# Altium schematic sheet Charging IC.SchDoc
size A; SheetNumber: 2; SheetTotal: 3; SPICEModelCacheWWOUKJZP: <root> / <DocumentId>WWOUKJZP</DocumentId> / <CacheFrame Number="0"> / <Model Name="umk107b7474_a-tr" Kind="CKT"> / <Text>* UMK107B7474_A-TR     SPICE MODEL  ( General Type ) / *-------------------------------------------------------------------------------------------------------- / * Model Generated by TAIYO YUDEN Corporation (http://www.ty-top.com) / * Version 1.0 / * TAIYO YUDEN Control No. 170508_110119 / * Copyright(c) 2012 TAIYO YUDEN CO.,LTD. All Rights Reserved. / *-------------------------------------------------------------------------------------------------------- / * / * Products Name : Multilayer Ceramic Capacitors / * / * Characteristics : / *     Capacitance : 0.47 uF , Rated Voltage : 50V , TCC : X7R / *     Case Size : 1.6 x 0.8 / 0.063 x 0.031 [mm/inch] , Thickness : 0.8 / 0.031 [mm/inch] / *     (Conditions: Temperature = 25 degC , DC Bias Current/Voltage = 0A / 0V) / * / * Frequency Range : 40Hz - 3GHz / * / * External Node Assignments : / * / *  1  o---| |---o  2 / * / *-------------------------------------------------------------------------------------------------------- / .SubCkt UMK107B7474_A-TR 1 2 / **************************** / C0 1 110 0.3527u / Cm 1 101 0.045459u / C1 101 102 0.11169u / Rc1 101 102 6.9463k / C2 102 103 0.051734u / Rc2 102 103 650.62 / C3 103 110 0.038139u / Rc3 103 110 34.263 / C2m 1 301 0.059649u / C21 301 302 0.33581u / Rc21 301 302 11.28k / C22 302 303 0.20392u / Rc22 302 303 18.494k / C23 303 304 0.29488u / Rc23 303 304 12.333k / C24 304 305 0.15021u / Rc24 304 305 1.1637k / C25 305 306 0.15017u / Rc25 305 306 1.0968k / C26 306 307 0.081575u / Rc26 306 307 74.316 / C27 307 308 0.067021u / Rc27 307 308 74.754 / C28 308 309 0.05622u / Rc28 308 309 85.848 / C29 309 110 3839.3p / Rc29 309 110 14.414 / Rp0 1 110 1.06382978723404G / L0 110 120 0.25717n / Lm 120 130 0.18418n / L1 120 121 0.16238n / RL1 121 130 0.10645 / L2 120 122 1.5526n / RL2 122 130 1.0028 / L3 120 123 2.68n / RL3 123 130 1.6719 / CR 120 124 0.037577u / LR 124 125 0.31279n / RR 125 130 90.675m / CL 130 140 1.8724p / LL 130 140 0.25802n / RL 130 140 37.565 / Rs 140 2 10.204m / **************************** / .ends UMK107B7474_A-TR</Text> / </Model> / </CacheFrame> / </root>
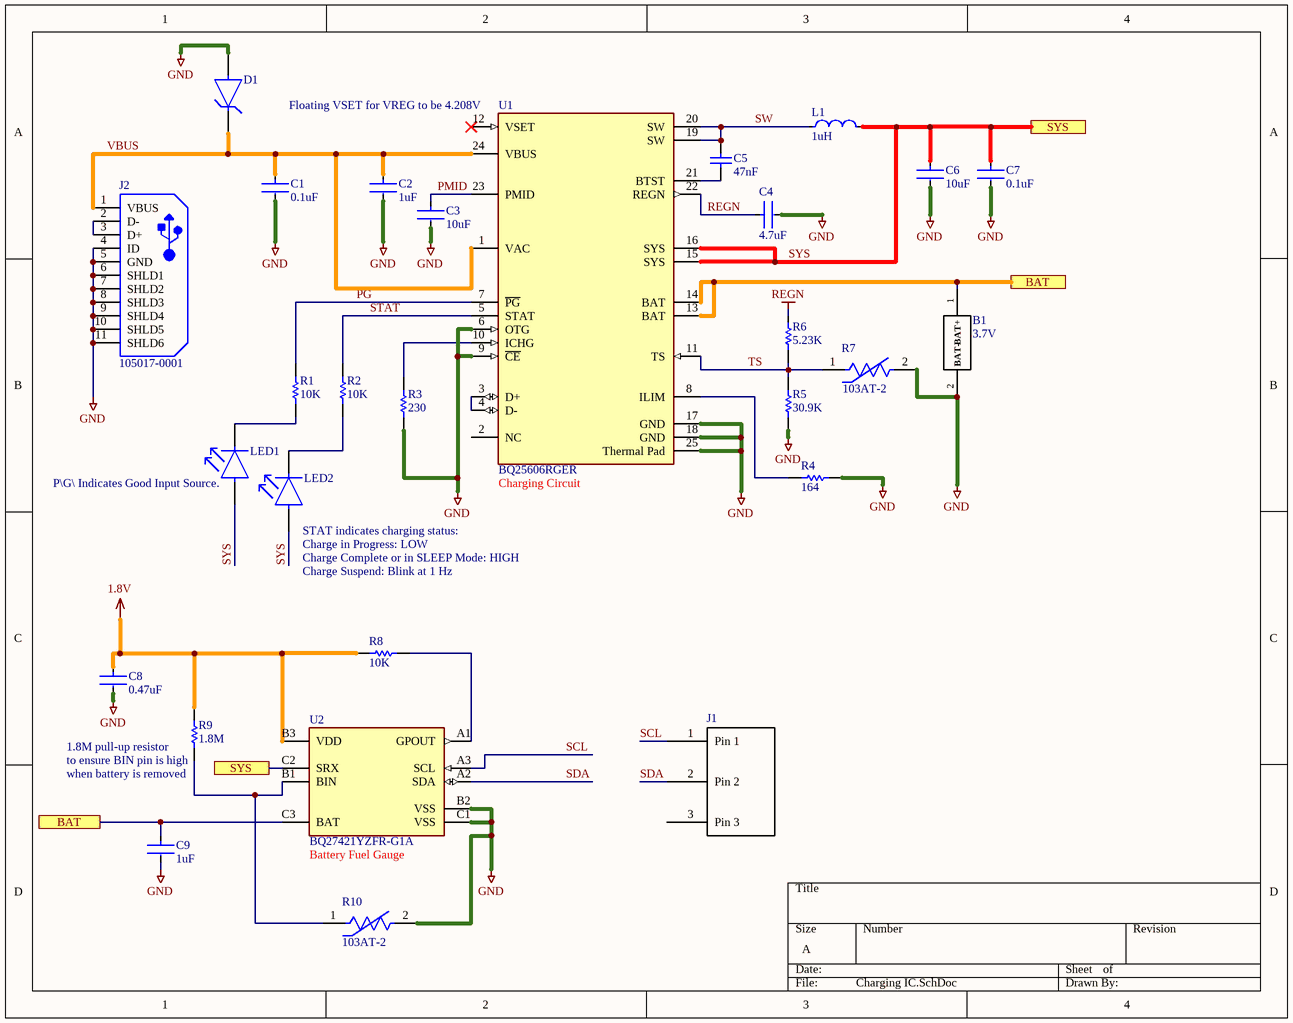
[diagram p0: Charging IC.SchDoc]

## Parts
B1  3.7V
C1  0.1uF  [FP-CC0603-DA-MFG]
C2  1uF  [FP-0603-L_1_6_0_15-W_0_8-IPC_C]
C3  10uF  [FP-GRM188-0_1-e0_2_0_55-IPC_A]
C4  4.7uF  [FP-C0603-CG-MFG]
C5  47nF  [CAPC1608X90X35ML10T15]
C6  10uF  [FP-GRM188-0_1-e0_2_0_55-IPC_A]
C7  0.1uF  [FP-CC0603-DA-MFG]
C8  0.47uF  [FP-0603-L_1_6_0_1-W_0_8_0-IPC_B]
C9  1uF  [FP-0603-L_1_6_0_15-W_0_8-IPC_C]
D1  CZRU52C3V3  [FP-0603-SOD-523F-MFG]  (value not drawn)
J1  (no value)
J2  105017-0001  [USB-MICRO-B_V]
L1  1uH  [FP-MLZ1608-MFG]
LED1  LTST-C190GKT  [FP-LTST-C190GKT-MFG]  (value not drawn)
LED2  LTST-C190GKT  [FP-LTST-C190GKT-MFG]  (value not drawn)
R1  10K  [RESC1609X50X30NL8T20]
R2  10K  [RESC1609X50X30NL8T20]
R3  230  [RESC1609X50X30ML8T20]
R4  164  [RESC1609X50X30ML8T20]
R5  30.9K  [RESC1608X55X30ML15T15]
R6  5.23K  [RESC1608X55X30NL15T15]
R7  103AT-2  [FP-103AT-2-MFG]
R8  10K  [RESC1609X50X30NL8T20]
R9  1.8M  [RESC1609X50X30LL10T20]
R10  103AT-2  [FP-103AT-2-MFG]
U1  BQ25606RGER  [FP-RGE0024H-IPC_C]
U2  BQ27421YZFR-G1A  [FP-YZF0009-C01-MFG]

## Ports
BAT (see Sheet1[1B]), SYS (see Sheet1[1A], Buck and Boost Converters[1A], Buck and Boost Converters[1C])

## Nets
1.8V: C8.1 R8.2 R9.2 U2.B3(VDD)
GND: B1.2(BAT-) C1.2 C2.2 C3.2 C4.2 C6.2 C7.2 C8.2 C9.2 D1.2(A) J2.4(ID) J2.5(GND) J2.6(SHLD1) J2.7(SHLD2) J2.8(SHLD3) J2.9(SHLD4) J2.10(SHLD5) J2.11(SHLD6) R3.2 R4.2 R5.1 R7.2 R10.2 U1.6(OTG) U1.9(~{CE}) U1.17(GND) U1.18(GND) U1.25(Thermal_Pad) U2.B2(VSS) U2.C1(VSS)
REGN: C4.1 R6.2 U1.22(REGN)
BAT: B1.1(BAT+) C9.1 U1.13(BAT) U1.14(BAT) U2.C3(BAT) ; port BAT
PG: R1.2 U1.7(~{PG})
PMID: C3.1 U1.23(PMID)
SCL: J1.1(Pin_1) U2.A3(SCL)
SDA: J1.2(Pin_2) U2.A2(SDA)
STAT: R2.2 U1.5(STAT)
SW: C5.2 L1.1 U1.19(SW) U1.20(SW)
SYS: C6.1 C7.1 L1.2 LED1.2(A) LED2.2(A) U1.15(SYS) U1.16(SYS) U2.C2(SRX) ; port SYS
TS: R5.2 R6.1 R7.1 U1.11(TS)
VBUS: C1.1 C2.1 D1.1(C) J2.1(VBUS) U1.1(VAC) U1.24(VBUS)
NetC5_1: C5.1 U1.21(BTST)
NetJ2_2: J2.2(D-) J2.3(D+)
NetLED1_1: LED1.1(C) R1.1
NetLED2_1: LED2.1(C) R2.1
NetR3_1: R3.1 U1.10(ICHG)
NetR4_1: R4.1 U1.8(ILIM)
NetR8_1: R8.1 U2.A1(GPOUT)
NetR9_1: R9.1 R10.1 U2.B1(BIN)
NetU1_3: U1.3(D+) U1.4(D-)

Not connected (* = marked no-connect by the designer): J1 3(Pin_3); U1 2(NC) 12(VSET)*

## Notes on the sheet
- (near U1) Floating VSET for VREG to be 4.208V
- (near LED1) P\G\ Indicates Good Input Source.
- (near U1) Charging Circuit
- (near LED2) STAT indicates charging status:
- (near LED2) Charge in Progress: LOW
- (near LED2) Charge Complete or in SLEEP Mode: HIGH
- Charge Suspend: Blink at 1 Hz
- (near R9) 1.8M pull-up resistor
- (near R9) to ensure BIN pin is high
- (near R9) when battery is removed
- (near U2) Battery Fuel Gauge

## Library data of the parts
B1 = B1
C1 C7 = CMP-2000-05002-2: CAP CER 0.1UF 16V X7R 0603; Manufacturer Part Number: CC0603KRX7R7BB104; Manufacturer: YAGEO; Tolerance: 0.1; Value: 100 nF; Temperature Coefficient: 15%; Material: Ceramic; Voltage Rating: 16 V; Package: CC0603-DA; ComponentLink2Description: Datasheet; Octopart: https://octopart.com/cc0603krx7r7bb104-yageo-192941; Temperature Range High: +125°C; Digikey Description: CAP CER 0.1UF 16V X7R 0603; Voltage: 16 V; Device Class L2: Capacitors; Height: 0.9mm; Temperature: -55°C to +125°C; Device Class L1: Passive Components; Device Class L3: Ceramic Capacitors; ComponentLink2URL: http://www.yageo.com/documents/recent/UPY-GPHC_X7R_6.3V-to-50V_18.pdf; Footprint Url: http://www.yageo.com/exep/pages/download/literatures/UPY-C_GEN_24.pdf; RoHS: TRUE; Temperature Range Low: -55°C; Temperature Characteristic: X7R; Lead Free: Yes; Capacitance: 100 nF; Category: Cap; Mouser Description: Multilayer Ceramic Capacitor, CC Series, 0.1 - F, - 10%, X7R, 16 V, 0603 [1608 Metric]; Automotive: No
C2 C9 = CMP-2000-07531-4: Ceramic Capacitor General Use 1uF ±10% 50V X7R 0603; Series: M; Width: 0.031inch; Mount: Surface Mount; Radiation Hardening: No; Voltage Rating (DC): 50V; Packaging: Tape and Reel; Termination: SMD/SMT; Depth: 0.8mm; Case Code (Metric): 1608; Case Code (Imperial): 0603; Height: 0.8mm; Voltage Rating: 50V; Package Quantity: 1; Halogen Free: Halogen Free; Dielectric: X7R; Min Operating Temperature: -55°C; Length: 1.6mm; Construction: Flat; Tolerance: 10%; Thickness: 0.037inch; Max Operating Temperature: 125°C; Case/Package: 0603; Capacitance: 1uF; RoHS Compliant: Yes
C3 C6 = CMP-2006-02792-2: Chip Multilayer Ceramic Capacitors for General Purpose, 0603, 10uF, X5R, 15%, 20%, 6.3V; Packaging: Tape and Reel; Voltage Rating (DC): 6.3V; Width: 0.031inch; Termination: SMD/SMT; Dielectric: X5R; Package Quantity: 4000; Voltage Rating: 6.3V; Capacitance: 10uF; Case/Package: 0603; Min Operating Temperature: -55°C; Voltage: 6.3V; Length: 1.6mm; Thickness: 0.035inch; Lead Free: Lead Free; Depth: 0.8mm; Case Code (Imperial): 0603; Max Operating Temperature: 85°C; Material: Ceramic; Height: 0.8mm; Tolerance: 20%; Mount: Surface Mount; REACH SVHC: No SVHC; Radiation Hardening: No; Case Code (Metric): 1608
C4 = CMP-2006-02256-2: CAP CER 4.7UF 6.3V X5R 0603; Manufacturer: Kemet; Manufacturer Part Number: C0603C475K9PACTU; Temperature Coefficient: 15%; Tolerance: 10%; Material: Ceramic; Device Class L3: Ceramic Capacitors; RoHS: TRUE; Value: 4.7uF; Lead Free: Yes; ComponentLink2Description: Datasheet; Mouser Description: Multilayer Ceramic Capacitors MLCC - SMD/SMT 6.3volts 4.7uF X5R 10%; Package: C0603-CG; Digikey Description: CAP CER 4.7UF 6.3V X5R 0603; ComponentLink2URL: https://content.kemet.com/datasheets/KEM_C1006_X5R_SMD.pdf; Category: Cap; Temperature Range Low: -55°C; Capacitance: 4.7uF; Temperature: -55°C to +85°C; Octopart: https://octopart.com/c0603c475k9pactu-kemet-104242; Ipc Land Pattern Name: CAPC16080X80; Voltage Rating: 6.3V; Temperature Range High: +85°C; Height: 0.9mm; Temperature Characteristic: X5R; Device Class L1: Passive Components; Automotive: No; Device Class L2: Capacitors
C5 = CMP-2006-02927-1: Manufacturer: Murata; Part Number: GRM188R71H473KA61D
C8 = CMP-14477-000135-2: None; Dielectric: X7R; Voltage Rating: 50V; Capacitance: 470nF; Tolerance: 10%; Series: M; Package Quantity: 1; Radiation Hardening: No; Packaging: Tape and Reel; Length: 1.6mm; Min Operating Temperature: -55°C; Case Code (Imperial): 0603; Construction: Flat; Max Operating Temperature: 125°C; Thickness: 0.035inch; Case Code (Metric): 1608; Depth: 0.8mm; Voltage: 50V; Case/Package: 0603; RoHS Compliant: Yes; Mount: Surface Mount; Lead Free: Lead Free; Width: 0.031inch; Halogen Free: Halogen Free; Height: 0.8mm; Termination: SMD/SMT; Voltage Rating (DC): 50V
D1 = CMP-20229-000003-1: DIODE ZENER 3.3V 150MW 0603; Zener Current: 5mA; Tolerance: 5%; Output Current: 500mA; Impedance: 95R; Element Configuration: Single; Max Reverse Leakage Current: 25uA; Max Operating Temperature: 125°C; Max Power Dissipation: 150mW; Power Rating: 150mW; Lead Free: Lead Free; Mount: Surface Mount; Packaging: Tape and Reel; Voltage Tolerance: 5%; Power Dissipation: 150mW; Zener Voltage: 3.3V; Min Operating Temperature: -55°C; Case/Package: SMD/SMT; Voltage Rating (DC): 3.3V; Package Quantity: 1
J1 = Component_1
J2 = CMP-2000-05827-1: Micro-USB B Receptacle, Right Angle, Bottom Mount, Surface Mount, with Solder Tabs, -30 to 85 degC, 5-Pin USB, RoHS, Tape and Reel; Manufacturer: Molex; Featured Product: Micro-USBConnectorsUSBConnectors; Other Names: WM1399DKR; Package Version: Rev. F, 12/2012; Number of Contacts: 5; Connector Type: USB-microB; Catalog Drawings: 1050170001; 3D Model: 105017-0001.stp; Mating Products: WM17145-ND-CABLEMICROUSBBTOSTDA1.0MWM17147-ND-CABLEMICROUSBBTOSTDA2.0MWM17146-ND-CABLEMICROUSBBTOSTDA1.5M; PCN Assembly/Origin: ResinSupplier21/Oct/2015; Voltage - Max: 30V; Online Catalog: Molex-MicroUSB; Manufacturer URL: http://www.molex.com/; Package Description: 5-Leads USB, Micro B, Body 7.5 x 5 mm, Pitch 0.65 mm; Datasheet URL: http://www.molex.com/elqNow/elqRedir.htm?ref=http://www.molex.com/webdocs/datasheets/pdf/en-us/1050170001_IO_CONNECTORS.pdf; Ingress Protection: -; Datasheet Version: 03/2016; Mounting Type: BoardCutout,SurfaceMount,RightAngle; Circuits: 5; Standard Package: 1; Package Reference: MICRO-B; Package URL: http://www.molex.com/pdm_docs/sd/1050170001_sd.pdf; Category: Connectors,Interconnects; Series: -; RoHS Information: 1050170001CertofCompliance; Features: Shielded,SolderRetention; Family: USB,DVI,HDMIConnectors; Specifications: -; Gender: Receptacle; Packaging: Digi-Reel®; Mounting Technology: SurfaceMount
L1 = CMP-08253-000001-2: FIXED IND 1UH 600MA 150 MOHM SMD; Self Resonant Frequency: 170MHz; Shielding: Shielded; Core Material: Ferrite; Tolerance: 20%; Test Frequency: 10MHz; DC Resistance (DCR): 195mR; Saturation Current: 190mA; Case Code (Imperial): 0603; Case Code (Metric): 1608; Current Rating: 600mA; Height - Seated (Max): 0.037inch; RoHS Compliant: Yes; Case/Package: 0603; Length: 0.063inch; Mount: Surface Mount; Package Quantity: 4000; Max Operating Temperature: 125°C; Inductance: 1uH; Min Operating Temperature: -55°C; Width: 0.031inch; Lead Free: Lead Free; Packaging: Tape and Reel
LED1 LED2 = CMP-22017-000005-2: LED GREEN CLEAR CHIP SMD; Dominant Wavelength: 569nm; Reverse Voltage: 5V; Lens Color: Colorless; Viewing Angle: 130°; Voltage: 2V; Forward Current: 30mA; Power Dissipation: 100mW; Luminous Intensity: 6mcd; Number of LEDs: 1; Forward Voltage: 2.1V; Wavelength: 565nm; Test Current: 10mA; Min Operating Temperature: -55°C; Lens Style: Clear; Mount: Surface Mount; Width: 0.8mm; Packaging: Tape and Reel; Lens Transparency: Clear; Case Code (Metric): 1608; Depth: 0.8mm; Case Code (Imperial): 0603; Case/Package: 0603; Number of Pins: 2; Max Operating Temperature: 85°C; Lead Free: Lead Free; Number of Elements: 1; Length: 1.6mm; Height: 0.8mm; Package Quantity: 1; Power Rating: 100mW; Radiation Hardening: No; Illumination Color: Green; Color: Green
R1 R2 R8 = CMP-1666-00005-4: Chip Resistor, 10 KOhm, +/- 1%, 100 mW, -55 to 155 degC, 0603 (1608 Metric), RoHS, Tape and Reel; Manufacturer: Vishay Semiconductor; Voltage Rating: 75 V; Max Operating Temperature: 155 degC; PackageDescription: 2-Pin Surface Mount Device, Body 1.575 x 0.85 mm; ComponentLink1Description: Manufacturer URL; RoHSCompliant: true; PackageReference: 0603; REACH SVHC: Unknown; Length: 1.55 mm; DatasheetVersion: 06/2012; Packaging: Tape and Reel; Min Operating Temperature: -55 degC; Mounting Technology: Surface Mount; ComponentLink2URL: https://datasheet.ciiva.com/11809/0900766b80d98afc-11809037.pdf; Height: 0.45 mm; ComponentLink2Description: Datasheet; Package Quantity: 5000; ComponentLink1URL: http://www.vishay.com/
R3 R4 = CMP-2000-03824-5: Chip Resistor, 100 Ohm, +/- 1%, 100 mW,-55 to 155 degC, 0603 (1608 Metric), RoHS, Tape and Ree; Manufacturer: Vishay Semiconductor; ComponentLink2URL: http://www.vishay.com/docs/20035/dcrcwe3.pdf; ComponentLink1URL: http://www.vishay.com/; Mounting Technology: Surface Mount; ComponentLink1Description: Manufacturer URL; ComponentLink2Description: Datasheet; PackageDescription: 2-Pin Surface Mount Device, Body 1.575 x 0.85 mm; PackageReference: 0603; DatasheetVersion: 06/2012
R5 = CMP-2000-00421-1: Manufacturer: Panasonic; Part Number: ERJ-3EKF3092V
R6 = CMP-2000-00550-1: Manufacturer: Panasonic; Part Number: ERJ-3EKF5231V
R7 R10 = CMP-2000-05824-2: Thermistor NTC 10KOhm 1% 2-Pin; Resistance: 10kR; Lead Pitch: 2.54mm; Height: 2.4mm; Max Operating Temperature: 110°C; Width: 3.7mm; RoHS Compliant: Yes; Min Operating Temperature: -50°C; Termination: Radial; Packaging: Bulk; Number of Pins: 2; Series: AT; Tolerance: 1%; Length: 17mm
R9 = CMP-2000-03043-1: Part Number: CRCW06031M80JNEA; Manufacturer: Vishay Dale
U1 = CMP-04911-000009-2: IC BATT CHG LI-ION 1 CELL 24VQFN; Battery Pack Voltage: 4.4V; Interface: USB; Number of Cells: 1; Max Charge Current: 3A; Fault Protection: Over Voltage; Max Supply Voltage: 13.5V; Max Operating Temperature: 85°C; Mount: Surface Mount; Min Operating Temperature: -40°C; Packaging: Tape and Reel; Case/Package: VQFN
U2 = CMP-04911-000026-1: IC BATT FUEL GAUGE LICO2 9DSBGA; Operating Supply Current: 93uA; Number of Cells: 1; Max Supply Voltage: 4.5V; Min Supply Voltage: 2.45V; Capacity: 8000mAh; Output Voltage: 1.8V; Interface: I2C; Min Operating Temperature: -40°C; Number of Pins: 9; Max Operating Temperature: 85°C; Packaging: Tape and Reel; Mount: Surface Mount; Package Quantity: 3000; RoHS Compliant: Yes; Contact Plating: Copper; Lead Free: Lead Free